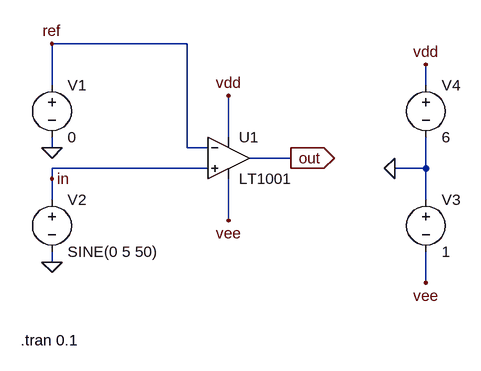
[diagram p0: schematic comparator.asc]
comparator.asc, the LTspice schematic file:
Version 4
SHEET 1 880 680
WIRE 112 -32 -96 -32
WIRE -96 32 -96 -32
WIRE 480 32 480 0
WIRE 176 112 176 48
WIRE -96 128 -96 112
WIRE 112 128 112 -32
WIRE 144 128 112 128
WIRE 272 144 208 144
WIRE 144 160 -96 160
WIRE 480 160 480 112
WIRE 480 160 432 160
WIRE -96 176 -96 160
WIRE -96 208 -96 176
WIRE 480 208 480 160
WIRE 176 240 176 176
WIRE -96 304 -96 288
WIRE 480 336 480 288
FLAG 272 144 out
IOPIN 272 144 Out
FLAG 176 48 vdd
FLAG 480 0 vdd
FLAG 176 240 vee
FLAG 480 336 vee
FLAG -96 128 0
FLAG -96 304 0
FLAG -96 176 in
FLAG -96 -32 ref
FLAG 432 160 0
SYMBOL OpAmps\\LT1001 176 80 R0
SYMATTR InstName U1
SYMBOL voltage -96 16 R0
WINDOW 123 0 0 Left 0
WINDOW 39 0 0 Left 0
SYMATTR InstName V1
SYMATTR Value 0
SYMBOL voltage -96 192 R0
WINDOW 123 0 0 Left 0
WINDOW 39 0 0 Left 0
SYMATTR InstName V2
SYMATTR Value SINE(0 5 50)
SYMBOL voltage 480 192 R0
WINDOW 123 0 0 Left 0
WINDOW 39 0 0 Left 0
SYMATTR InstName V3
SYMATTR Value 1
SYMBOL voltage 480 16 R0
WINDOW 123 0 0 Left 0
WINDOW 39 0 0 Left 0
SYMATTR InstName V4
SYMATTR Value 6
TEXT -144 424 Left 2 !.tran 0.1

The netlist it stands for:
* comparator.asc
XU1 in ref vdd vee out LT1001  ; pins In+ In- V+ V- OUT
V1 ref 0 0
V2 in 0 SINE(0 5 50)
V3 0 vee 1
V4 vdd 0 6
.tran 0.1
.lib LTC.lib
.backanno
.end

* Results of the author's LTspice run, read from the files saved beside the schematic
* Operating Point, zero values left out:
*   V(vdd) = 6 V
*   V(vee) = -1 V
*   V(out) = 5.062 V
*   I(V4) = -2.25 mA
*   I(V3) = -2.25 mA
*   I(V2) = 4.464 pA
*   I(V1) = 4.464 pA
*   Ix(u1:1) = -4.464 pA
*   Ix(u1:2) = -4.464 pA
*   Ix(u1:3) = 2.25 mA
*   Ix(u1:4) = -2.25 mA
*   Ix(u1:5) = -5.125 pA
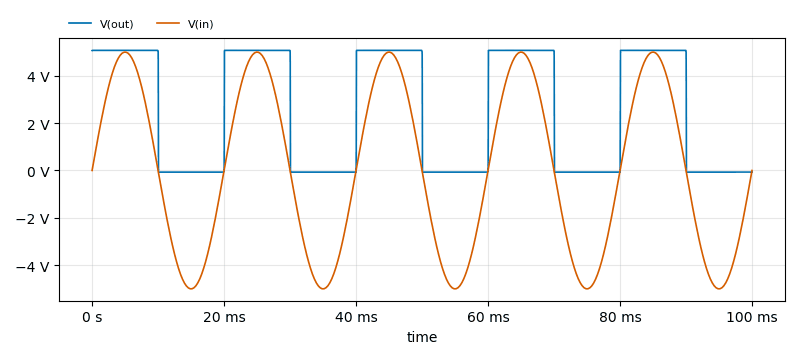
[diagram p1: Transient Analysis of comparator.asc, plotted from the saved traces]
* Transient Analysis, 1 run:
*   V(out): min -70.45 mV, max 5.071 V, average 2.503 V, rms 3.586 V, last -62.05 mV
*   V(in): min -4.996 V, max 4.997 V, average -18.28 µV, rms 3.535 V, last 0 V